# Altium project new_version.PrjPcb
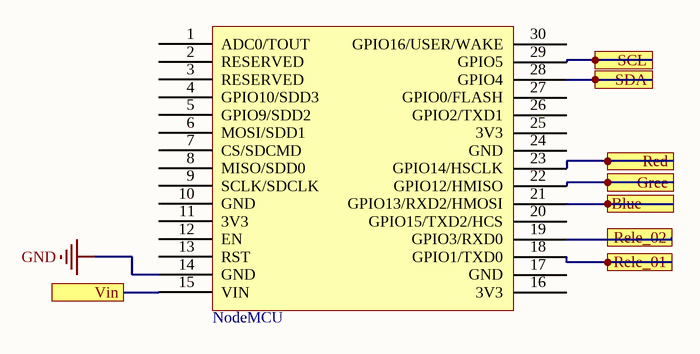
[diagram p0: Sheet1.SchDoc]
1 sheet, 1 parts. Net scope: flat (ports and power ports of the same name join across sheets).

## Sheet Sheet1.SchDoc
size A4

### Parts
NodeMCU  ESP8266 Development kit  [DIV_NodeMCU_Socket]  (value not drawn)

### Ports
Blue, Gree, Red, Rele_01, Rele_02, SCL, SDA, Vin

### Nets
GND: NodeMCU.14(GND)
NetNodeMCU_15: NodeMCU.15(VIN) ; port Vin
NetNodeMCU_18: NodeMCU.18(GPIO1/TXD0) ; port Rele_01
NetNodeMCU_19: NodeMCU.19(GPIO3/RXD0) ; port Rele_02
NetNodeMCU_21: NodeMCU.21(GPIO13/RXD2/HMOSI) ; port Blue
NetNodeMCU_22: NodeMCU.22(GPIO12/HMISO) ; port Gree
NetNodeMCU_23: NodeMCU.23(GPIO14/HSCLK) ; port Red
NetNodeMCU_28: NodeMCU.28(GPIO4) ; port SDA
NetNodeMCU_29: NodeMCU.29(GPIO5) ; port SCL

Not connected (* = marked no-connect by the designer): NodeMCU 1(ADC0/TOUT) 2(RESERVED) 3(RESERVED) 4(GPIO10/SDD3) 5(GPIO9/SDD2) 6(MOSI/SDD1) 7(CS/SDCMD) 8(MISO/SDD0) 9(SCLK/SDCLK) 10(GND) 11(3V3) 12(EN) 13(RST) 16(3V3) 17(GND) 20(GPIO15/TXD2/HCS) 24(GND) 25(3V3) 26(GPIO2/TXD1) 27(GPIO0/FLASH) 30(GPIO16/USER/WAKE)

### Library data of the parts
NodeMCU = NodeMCU: Reference: https://bennthomsen.files.wordpress.com/2015/12/nodemcu_pinout_700-2.png; Schematic: https://raw.githubusercontent.com/nodemcu/nodemcu-devkit/master/Documents/NODEMCU_DEVKIT_SCH.png